# EAGLE design VerberBaby (EAGLE 9.6.0)
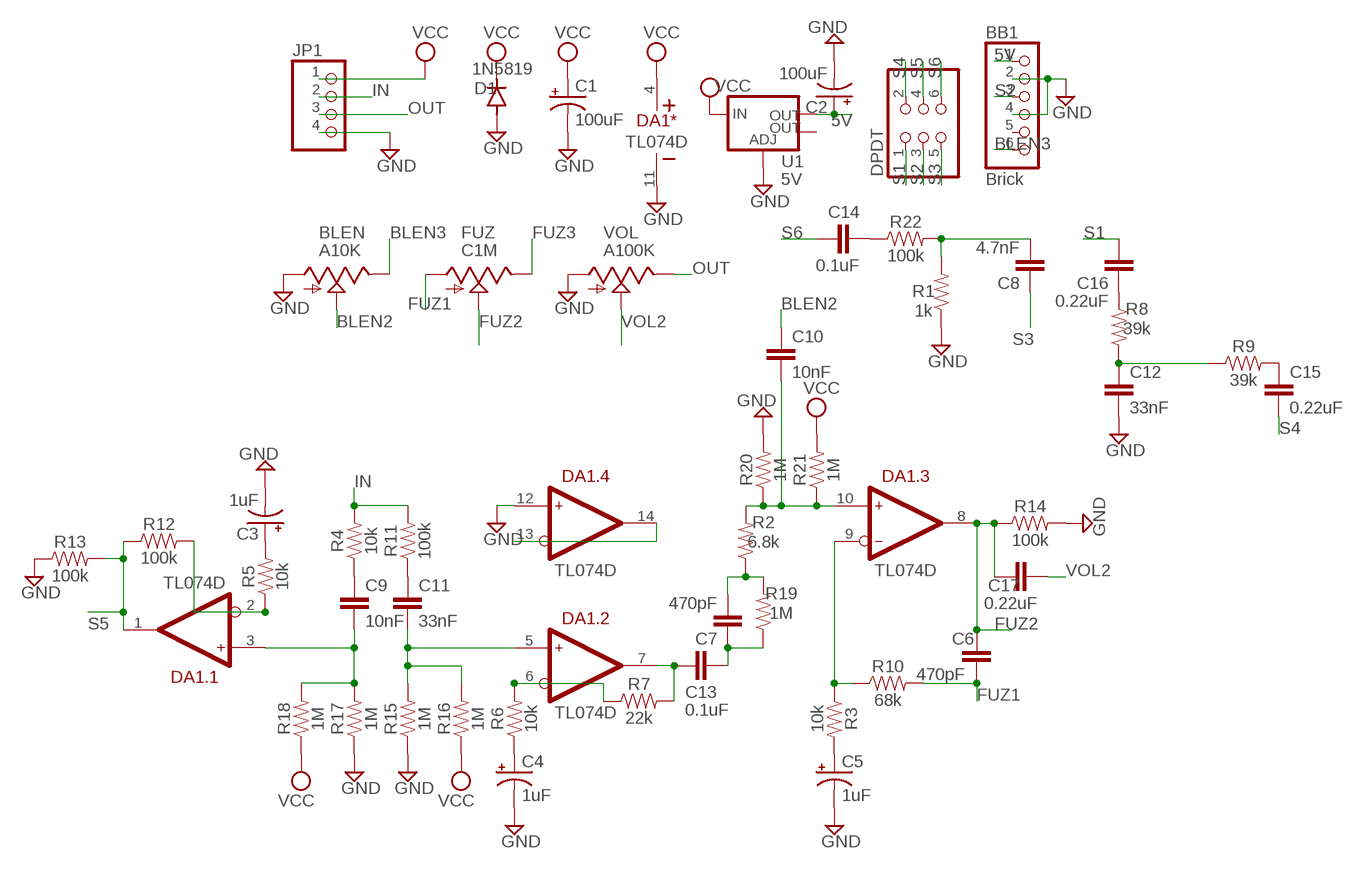
[diagram p0: schematic, sheet 1]

## Parts
BB1  Brick  PINHD-1X6  [1X06]
BLEN  A10K  9MM_SNAP-IN_POT_  [9MM_SNAP-IN_POT]
C1  100uF  CAP_SMD+THRUPAN_B  [PAN_B_SMD+THRU]
C2  100uF  CAP_SMD+THRUPAN_B  [PAN_B_SMD+THRU]
C3  1uF  CAP_SMD+THRUPAN_B  [PAN_B_SMD+THRU]
C4  1uF  CAP_SMD+THRUPAN_B  [PAN_B_SMD+THRU]
C5  1uF  CAP_SMD+THRUPAN_B  [PAN_B_SMD+THRU]
C6  470pF  470PF-0603-50V-5%  [0603]
C7  470pF  470PF-0603-50V-5%  [0603]
C8  4.7nF  4.7PF-0603-50V-5%  [0603]
C9  10nF  10NF-0603-50V-10%  [0603]
C10  10nF  10NF-0603-50V-10%  [0603]
C11  33nF  33NF-0603-50V-10%  [0603]
C12  33nF  33NF-0603-50V-10%  [0603]
C13  0.1uF  0.1UF-0603-25V-(+80/-20%)  [0603]
C14  0.1uF  0.1UF-0603-25V-(+80/-20%)  [0603]
C15  0.22uF  0.22UF-0603-25V-10%  [0603]
C16  0.22uF  0.22UF-0603-25V-10%  [0603]
C17  0.22uF  0.22UF-0603-25V-10%  [0603]
D1  1N5819  DIODE-SOD123  [SOD123]
DA1  TL074D  [SO-14]
DPDT  PINHD-2X3  [2X03]
FUZ  C1M  9MM_SNAP-IN_POT_  [9MM_SNAP-IN_POT]
JP1  PINHD-1X4  [1X04]
R1  1k  1KOHM-0603-1/10W-1%  [0603]
R2  6.8k  6.8KOHM-0603-1/10W-1%  [0603]
R3  10k  10KOHM-0603-1/10W-1%  [0603]
R4  10k  10KOHM-0603-1/10W-1%  [0603]
R5  10k  10KOHM-0603-1/10W-1%  [0603]
R6  10k  10KOHM-0603-1/10W-1%  [0603]
R7  22k  22KOHM-0603-1/10W-1%  [0603]
R8  39k  39KOHM-0603-1/10W-1%  [0603]
R9  39k  39KOHM-0603-1/10W-1%  [0603]
R10  68k  68.1KOHM-0603-1/10W-1%  [0603]
R11  100k  100KOHM-0603-1/10W-1%  [0603]
R12  100k  100KOHM-0603-1/10W-1%  [0603]
R13  100k  100KOHM-0603-1/10W-1%  [0603]
R14  100k  100KOHM-0603-1/10W-1%  [0603]
R15  1M  1MOHM-0603-1/4W-5%  [0603]
R16  1M  1MOHM-0603-1/4W-5%  [0603]
R17  1M  1MOHM-0603-1/4W-5%  [0603]
R18  1M  1MOHM-0603-1/4W-5%  [0603]
R19  1M  1MOHM-0603-1/4W-5%  [0603]
R20  1M  1MOHM-0603-1/4W-5%  [0603]
R21  1M  1MOHM-0603-1/4W-5%  [0603]
R22  100k  100KOHM-0603-1/10W-1%  [0603]
U1  5V  V_REG_LM1117SOT223  [SOT223]
VOL  A100K  9MM_SNAP-IN_POT_  [9MM_SNAP-IN_POT]

## Nets
5V: BB1.1 C2.+ C2.++(+) U1.2(OUT)
BLEN2: BLEN.2(S) C10.1
BLEN3: BB1.6 BLEN.3(E)
FUZ1: C6.2 FUZ.1(A) R10.2
FUZ2: C6.1 C17.1 DA1.8(.3:OUT) FUZ.2(S) R14.1
FUZ3: FUZ.3(E)
GND: BB1.2 BB1.4 BLEN.1(A) C1.- C1.--(-) C2.- C2.--(-) C3.- C3.--(-) C4.- C4.--(-) C5.- C5.--(-) C12.2 D1.A DA1.11(*:V-) DA1.12(.4:IN+) JP1.4 R1.1 R13.1 R14.2 R15.1 R17.1 R20.2 U1.1(ADJ) VOL.1(A)
IN: JP1.2 R4.2 R11.2
N1: DA1.9(.3:IN-) R3.1 R10.1
N$1: C11.1 R11.1
N$2: C9.1 R4.1
N$3: C11.2 DA1.5(.2:IN+) R15.2 R16.2
N$4: C9.2 DA1.3(.1:IN+) R17.2 R18.2
N$5: DA1.2(.1:IN-) R5.1 R12.2
N$6: C3.+ C3.++(+) R5.2
N$7: DA1.6(.2:IN-) R6.2 R7.1
N$8: C4.+ C4.++(+) R6.1
N$9: C13.2 DA1.7(.2:OUT) R7.2
N$10: C7.1 C13.1 R19.1
N$11: C7.2 R2.1 R19.2
N$12: C10.2 DA1.10(.3:IN+) R2.2 R20.1 R21.1
N$13: DA1.13(.4:IN-) DA1.14(.4:OUT)
N$14: C5.+ C5.++(+) R3.2
N$15: C14.2 R22.1
N$16: C8.2 R1.2 R22.2
N$17: C16.1 R8.2
N$18: C12.1 R8.1 R9.1
N$19: C15.1 R9.2
OUT: JP1.3 VOL.3(E)
S1: C16.2 DPDT.1
S2: BB1.3 DPDT.3
S3: C8.1 DPDT.5
S4: C15.2 DPDT.2
S5: DA1.1(.1:OUT) DPDT.4 R12.1 R13.2
S6: C14.1 DPDT.6
VCC: C1.+ C1.++(+) D1.C DA1.4(*:V+) JP1.1 R16.1 R18.1 R21.2 U1.3(IN)
VOL2: C17.2 VOL.2(S)
Unconnected: BB1.5 U1.4(OUT)

## Library data of the parts
BB1 = pinhead:PINHD-1X6: PIN HEADER
BLEN FUZ VOL = MusicThingModular:9MM_SNAP-IN_POT: 9mm vertical snap-in pot, Alpha / Panasonic style
C1-C5 = MusicThingModular:CAP_SMD+THRU
C6 C7 = SparkFun-Capacitors:470PF: 470pF ceramic capacitors A capacitor is a passive two-terminal electrical component used to store electrical energy temporarily in an electric field.; PROD_ID: CAP-07884
C8 = SparkFun-Capacitors:4.7PF: 4.7pF ceramic capacitors A capacitor is a passive two-terminal electrical component used to store electrical energy temporarily in an electric field.; PROD_ID: CAP-07880; VALUE: 4.7pF
C9 C10 = SparkFun-Capacitors:10NF: 0.01uF/10nF/10,000pF ceramic capacitors A capacitor is a passive two-terminal electrical component used to store electrical energy temporarily in an electric field. CAP-09321; PROD_ID: CAP-00867
C11 C12 = SparkFun-Capacitors:33NF: 33nF ceramic capacitors A capacitor is a passive two-terminal electrical component used to store electrical energy temporarily in an electric field.; PROD_ID: CAP-07887
C13 C14 = SparkFun-Capacitors:0.1UF: 0.1µF ceramic capacitors A capacitor is a passive two-terminal electrical component used to store electrical energy temporarily in an electric field.; PROD_ID: CAP-00810
C15-C17 = SparkFun-Capacitors:0.22UF: 0.22µF ceramic capacitors A capacitor is a passive two-terminal electrical component used to store electrical energy temporarily in an electric field.; PROD_ID: CAP-07822
D1 = diode:DIODE-: DIODE
DA1 = ic-ti:TL074
DPDT = pinhead:PINHD-2X3: PIN HEADER
JP1 = Connector:PINHD-1X4: PIN HEADER; CATEGORY: CONNECTOR; SUB-CATEGORY: PIN-HEADER
R1 = SparkFun-Resistors:1KOHM: 1kΩ resistor A resistor is a passive two-terminal electrical component that implements electrical resistance as a circuit element. Resistors act to reduce current flow, and, at the same time, act to lower voltage levels within circuits. - Wikipedia; PROD_ID: RES-07856
R2 = SparkFun-Resistors:6.8KOHM: 6.8kΩ resistor A resistor is a passive two-terminal electrical component that implements electrical resistance as a circuit element. Resistors act to reduce current flow, and, at the same time, act to lower voltage levels within circuits. - Wikipedia; PROD_ID: RES-08597
R3-R6 = SparkFun-Resistors:10KOHM: 10kΩ resistor A resistor is a passive two-terminal electrical component that implements electrical resistance as a circuit element. Resistors act to reduce current flow, and, at the same time, act to lower voltage levels within circuits. - Wikipedia; PROD_ID: RES-00824
R7 = SparkFun-Resistors:22KOHM: 22kΩ resistor A resistor is a passive two-terminal electrical component that implements electrical resistance as a circuit element. Resistors act to reduce current flow, and, at the same time, act to lower voltage levels within circuits. - Wikipedia; PROD_ID: RES-07853
R8 R9 = SparkFun-Resistors:39KOHM: 39kΩ resistor A resistor is a passive two-terminal electrical component that implements electrical resistance as a circuit element. Resistors act to reduce current flow, and, at the same time, act to lower voltage levels within circuits. - Wikipedia; PROD_ID: RES-12377
R10 = SparkFun-Resistors:68.1KOHM: 68.1kΩ resistor A resistor is a passive two-terminal electrical component that implements electrical resistance as a circuit element. Resistors act to reduce current flow, and, at the same time, act to lower voltage levels within circuits. - Wikipedia; PROD_ID: RES-09380; VALUE: 68.1k
R11-R14 R22 = SparkFun-Resistors:100KOHM: 100kΩ resistor A resistor is a passive two-terminal electrical component that implements electrical resistance as a circuit element. Resistors act to reduce current flow, and, at the same time, act to lower voltage levels within circuits. - Wikipedia; PROD_ID: RES-07828
R15-R21 = SparkFun-Resistors:1MOHM: 1MΩ resistor A resistor is a passive two-terminal electrical component that implements electrical resistance as a circuit element. Resistors act to reduce current flow, and, at the same time, act to lower voltage levels within circuits. - Wikipedia; PROD_ID: RES-07868
U1 = SparkFun-IC-Power:V_REG_LM1117: Voltage Regulator LM1117 Standard adjustable voltage regulator but in SMD form. Spark Fun Electronics SKU : COM-00595; PROD_ID: VREG-08170

## Board
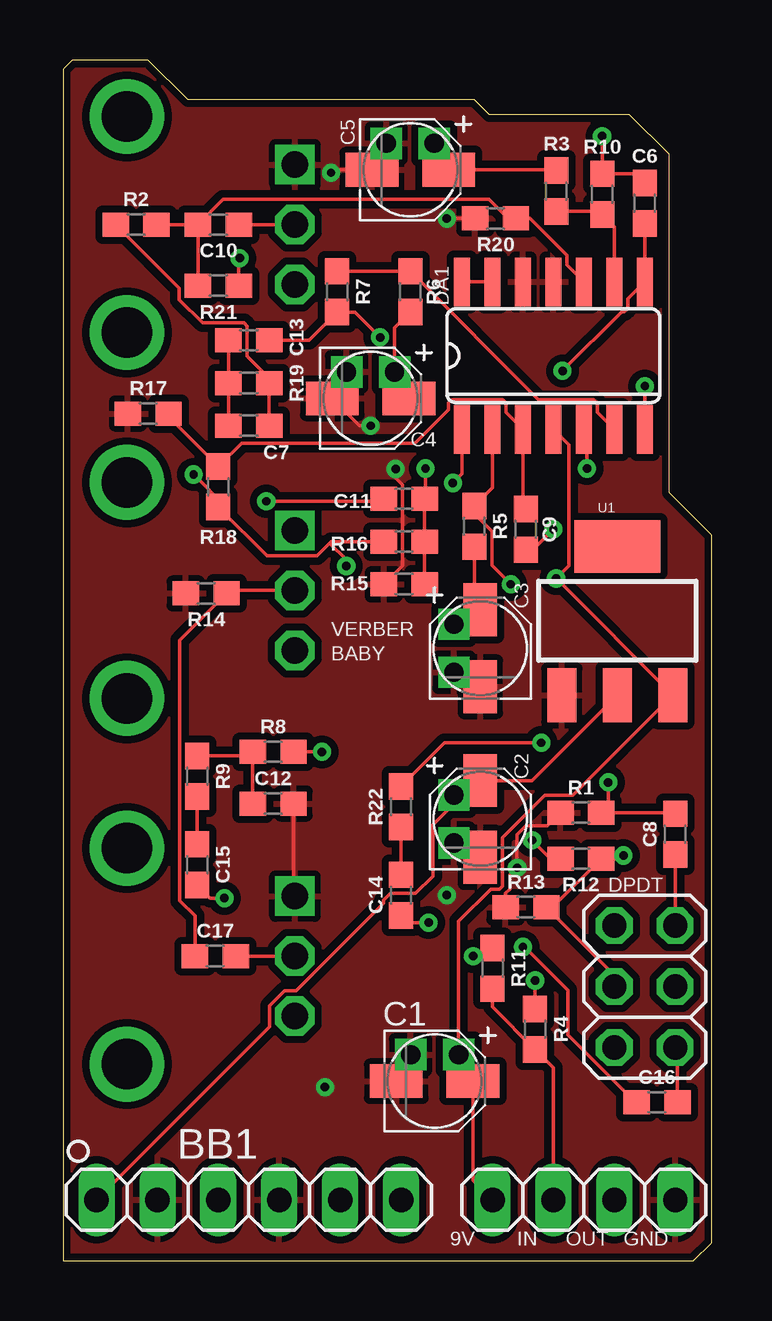
[diagram p1: board, top side]
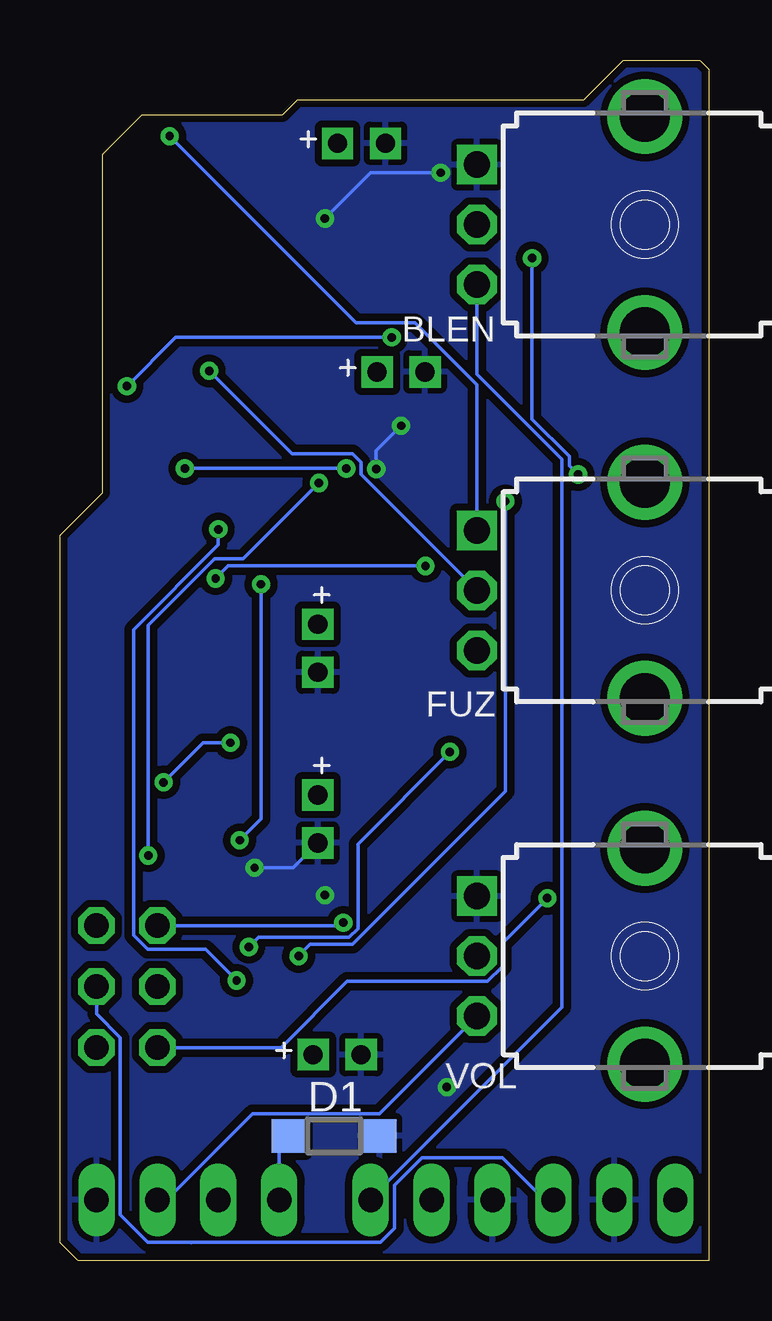
[diagram p2: board, bottom side, seen from below]

Size 27.05 x 50.04 mm. Coordinates in mm from the lower left corner, seen from the top.
Outline: 0,0 26.29,0 27.05,0.76 27.05,30.23 25.27,32 25.27,46.1 23.62,47.75 17.78,47.75 17.14,48.39 5.21,48.39 3.56,50.04 0.38,50.04 0,49.66 0,0
Copper layers (1*16): Top 0.035mm / dielectric 1.5mm / Bottom 0.035mm
Design rules "default *": minimum track width 6mil, minimum drill 0.35mm, track to track 6mil, track to pad 6mil, pad to pad 6mil, via to via 6mil, smd to smd 6mil, copper to edge 6mil, drill to drill 6mil, minimum pad ring 10mil, minimum via ring 8mil, stop-mask expansion 4mil, vias tented up to drill 0mil, thermal gap 10mil

### Footprints (pad centres in the part's own frame; a part is rotated, then mirrored left to right if it is on the bottom)
1X06 = drill 1.016 long: 1 -6.35,0; 2 -3.81,0; 3 -1.27,0; 4 1.27,0; 5 3.81,0; 6 6.35,0
9MM_SNAP-IN_POT = drill 1.1 square: 1 -2.5,-7 | drill 1.1 octagon: 2 0,-7; 3 2.5,-7 | drill 2.1 pad 2.794: CHASSIS1 -4.5,0; CHASSIS2 4.5,0
PAN_B_SMD+THRU = smd 2.2 x 1.4: + 1.6,0; - -1.6,0 | drill 0.8 pad 0.9 square: ++ 1,1.1; -- -1,1.1
0603 = smd 1.1 x 1: 1 -0.85,0; 2 0.85,0
SOD123 = smd 1.4 x 1.4: A 1.9,0; C -1.9,0
SO-14 = smd 0.66 x 2.032: 1 -3.81,-3.073; 2 -2.54,-3.073; 3 -1.27,-3.073; 4 0,-3.073; 5 1.27,-3.073; 6 2.54,-3.073; 7 3.81,-3.073; 8 3.81,3.073; 9 2.54,3.073; 10 1.27,3.073; 11 0,3.073; 12 -1.27,3.073; 13 -2.54,3.073; 14 -3.81,3.073
2X03 = drill 1.016 octagon: 1 -2.54,-1.27; 2 -2.54,1.27; 3 0,-1.27; 4 0,1.27; 5 2.54,-1.27; 6 2.54,1.27
1X04 = drill 1.016 long: 1 -3.81,0; 2 -1.27,0; 3 1.27,0; 4 3.81,0
SOT223 = smd 1.219 x 2.235: 1 -2.311,-3.099; 2 0,-3.099; 3 2.311,-3.099 | smd 3.6 x 2.2: 4 0,3.099

### Placement (x,y rotation side)
BB1  7.75,2.54 0 top
BLEN  2.67,43.18 270 bottom
C1  15.49,7.49 0 top
C2  17.4,18.41 90 top
C3  17.4,25.53 90 top
C4  12.83,35.94 0 top
C5  14.48,45.47 0 top
C6  24.26,44.07 90 top
C7  7.75,34.8 0 top
C8  25.53,17.78 90 top
C9  19.3,30.48 90 top
C10  6.48,43.18 180 top
C11  14.22,31.75 0 top
C12  8.76,19.05 0 top
C13  7.75,38.35 0 top
C14  14.1,15.24 90 top
C15  5.59,16.51 270 top
C16  24.77,6.6 0 top
C17  6.35,12.7 0 top
D1  15.62,5.21 0 bottom
DA1  20.45,37.72 0 top
DPDT  24.26,11.43 90 top
FUZ  2.67,27.94 270 bottom
JP1  21.72,2.54 0 top
R1  21.59,18.67 0 top
R2  3.05,43.18 0 top
R3  20.57,44.58 90 top
R4  19.68,9.65 270 top
R5  17.14,30.61 270 top
R6  14.48,40.39 90 top
R7  11.43,40.39 270 top
R8  8.76,21.21 0 top
R9  5.59,20.19 270 top
R10  22.48,44.45 90 top
R11  17.91,12.19 270 top
R12  21.59,16.76 180 top
R13  19.3,14.73 0 top
R14  5.97,27.81 180 top
R15  14.22,28.19 0 top
R16  14.22,29.97 0 top
R17  3.56,35.31 0 top
R18  6.48,32.26 90 top
R19  7.75,36.58 0 top
R20  18.03,43.43 180 top
R21  6.48,40.64 0 top
R22  14.1,18.92 90 top
U1  23.11,26.67 0 top
VOL  2.67,12.7 270 bottom

### Tracks (layer width: path | path; a pad name or v marks a point on that pad's centre or on a via)
5V
  Top 0.152: U1.2 19.56,20.02 C2.+ 16.8,19.41 16.38,19.41 | 16.38,19.41 C2.++ | BB1.1 8.61,9.76 8.61,10.64 9.23,11.25 9.71,11.25 13.37,14.91 13.37,15.04 13.64,15.31 14.69,15.31 15.42,16.04 15.42,18.16 16.38,19.13 16.38,19.41
BLEN2
  Top 0.152: C10.1 BLEN.2
BLEN3
  Bottom 0.152: BLEN.3 9.67,36.94 6.12,33.4 6.12,10.57 13.41,3.28 13.41,3.23 BB1.6
FUZ1  (via drill 0.35)
  Top 0.152: C6.2 23.88,45.3 R10.2 v22.48,46.86
  Bottom 0.152: v22.48,46.86 14.7,39.09 12.24,39.09 9.67,36.51 FUZ.1
FUZ2  (via drill 0.35)
  Top 0.152: C6.1 DA1.8 23.55,40.08 23.55,39.68 23.41,39.55 23.29,39.55 v20.83,37.08 | FUZ.2 6.95,27.94 R14.1 4.86,25.85 4.86,15.02 5.5,14.38 C17.1
  Bottom 0.152: v20.83,37.08 17.37,33.63 14.86,33.63 14.51,33.27 14.51,32.78 FUZ.2
GND  (via drill 0.35)
  Top 0.152: C4.- 12.37,34.8 v12.83,34.8 | v13.87,33 13.87,32.63 14.15,32.34 14.15,28.97 R15.1 | C5.- 11.3,45.47 v11.18,45.34 | v16,43.43 R20.2 | R1.1 20.2,18.13 19.31,18.13 18.93,17.76 v18.93,16.38 18.63,16.08 18.63,15.49 18.45,15.32 R13.1 | C2.- 16.9,16.82 C2.-- | VOL.1 9.61,15.25 C12.2
  Bottom 0.152: v12.83,34.8 13.87,33.76 v13.87,33 | v11.18,45.34 14.1,45.34 v16,43.43 | v18.93,16.38 17.33,16.38 C2.--
  other vias: 10.92,7.24 16,15.24
  pour Top (isolate 0.305): -0.51,50.8 -0.51,-0.38 -0.25,-0.64 26.42,-0.64 27.81,0.76 27.81,44.58 21.72,50.67 -0.38,50.67
  pour Bottom (isolate 0.305): -0.38,50.8 -0.38,0 0.38,-0.76 26.29,-0.76 27.81,0.76 27.81,44.7 21.84,50.67 21.59,50.67 21.46,50.8
IN
  Top 0.152: JP1.2 20.45,8.04 R4.2 17.91,10.58 R11.2
N1
  Top 0.152: R3.1 22.35,43.73 R10.1 22.99,43.09 DA1.9
N$1  (via drill 0.35)
  Top 0.152: R11.1 17.57,12.7 v17.1,12.7 | v8.48,31.65 13.28,31.65 C11.1
  Bottom 0.152: v17.1,12.7 16.61,13.19 14.86,13.19 8.48,19.57 v8.48,31.65
N$2  (via drill 0.35)
  Top 0.152: R4.1 v19.68,11.68 | v20.45,30.48 19.6,29.63 C9.1
  Bottom 0.152: v20.45,30.48 20.45,29.84 23.98,26.31 23.98,13.56 23.4,12.98 20.98,12.98 v19.68,11.68
N$3  (via drill 0.35)
  Top 0.152: DA1.5 21.84,34.52 v21.84,33.02 | v15.11,33.02 15.11,31.79 C11.2 R16.2 R15.2
  Bottom 0.152: v21.84,33.02 v15.11,33.02
N$4
  Top 0.152: C9.2 19.18,31.46 DA1.3 18.47,35.36 18.47,35.76 18.33,35.89 16.21,35.89 16.08,35.76 16.08,35.47 14.68,34.07 7.44,34.07 R18.2 4.41,35.18 R17.2
N$5  (via drill 0.35)
  Top 0.152: DA1.2 17.91,32.22 R5.1 17.14,31.13 17.87,30.4 17.87,28.99 v18.67,28.19 | R12.2 20.32,16.76 v19.56,17.53
  Bottom 0.152: v19.56,17.53 18.67,18.41 v18.67,28.19
N$6
  Top 0.152: R5.2 17.14,27.38 C3.+ 16.9,27.13 C3.++
N$7
  Top 0.152: DA1.6 22.28,35.36 22.28,35.76 22.14,35.89 19.82,35.89 14.52,41.19 R6.2 R7.1
N$8
  Top 0.152: C4.+ 14.43,36.44 C4.++ 13.83,38.88 R6.1
N$9  (via drill 0.35)
  Top 0.152: v13.22,38.48 12.16,39.54 R7.2 10.25,38.35 C13.2 | v24.26,36.45 DA1.7
  Bottom 0.152: v13.22,38.48 22.23,38.48 v24.26,36.45
N$10
  Top 0.152: C13.1 R19.1 C7.1
N$11
  Top 0.152: C7.2 R19.2 8.6,36.78 7.68,37.7 7.68,38.95 7.54,39.08 5.81,39.08 4.85,40.05 4.85,40.53 R2.1
N$12
  Top 0.152: R21.1 C10.2 | C10.2 R2.2 | DA1.10 21.01,41.5 21.01,41.9 19.48,43.43 18.92,43.43 R20.1 18.56,43.43 17.76,44.23 6.68,44.23 C10.2
N$13
  Top 0.152: DA1.13 DA1.14
N$14
  Top 0.152: R3.2 20.54,45.47 C5.+ 15.48,46.07 C5.++
N$15
  Top 0.152: C14.2 R22.1
N$16  (via drill 0.35)
  Top 0.152: C8.2 25.49,18.67 R1.2 22.73,18.96 v22.73,19.94 | R22.2 15.91,21.59 v19.94,21.59
  Bottom 0.152: v19.94,21.59 21.08,21.59 v22.73,19.94
N$17  (via drill 0.35)
  Top 0.152: C16.1 23.87,6.6 21.05,9.43 21.05,11.27 19.24,13.08 v19.18,13.08 | v10.79,21.21 R8.2
  Bottom 0.152: v19.18,13.08 18.77,13.49 14.99,13.49 14.63,13.85 14.63,17.37 v10.79,21.21
N$18
  Top 0.152: R9.1 7.75,21.04 R8.1 C12.1
N$19
  Top 0.152: C15.1 R9.2
OUT
  Bottom 0.152: VOL.3 13.73,6.14 19.01,6.14 22.61,2.54 JP1.3
S1
  Top 0.152: C16.2 25.61,8.8 DPDT.1
S2
  Bottom 0.152: BB1.3 6.85,2.54 8.61,4.29 11.97,4.29 13.11,3.15 13.11,1.37 13.69,0.79 21.57,0.79 21.59,0.76 21.61,0.79 23.4,0.79 24.54,1.93 24.54,9.3 25.53,10.29 DPDT.3
S3
  Top 0.152: DPDT.5 C8.1
S4  (via drill 0.35)
  Top 0.152: v6.73,15.11 6.13,15.11 C15.2
  Bottom 0.152: DPDT.2 17.83,8.89 15.07,11.65 9.23,11.65 8.61,12.26 8.61,13.23 v6.73,15.11
S5  (via drill 0.35)
  Top 0.152: DPDT.4 22.99,11.9 R13.2 20.41,14.73 R12.1 23.24,16.76 v23.37,16.89 | DA1.1 16.64,32.79 v16.26,32.41
  Bottom 0.152: v16.26,32.41 19.41,29.26 20.59,29.26 23.37,26.49 v23.37,16.89
S6  (via drill 0.35)
  Top 0.152: v15.24,14.1 14.39,14.1 C14.1
  Bottom 0.152: DPDT.6 15.37,13.97 v15.24,14.1
VCC  (via drill 0.35)
  Top 0.152: JP1.1 17.09,3.35 C1.+ 16.49,8.09 C1.++ 16.49,14.14 17.84,15.49 18.19,15.49 18.33,15.62 18.33,17.63 20.09,19.4 21.25,19.4 U1.3 v20.56,28.43 21.08,28.96 21.08,34.01 DA1.4 | 11.11,29.91 11.17,29.97 R16.1 | 11.11,29.91 10.59,29.39 8.5,29.39 6.5,31.39 | R18.1 6.5,31.39 | 11.11,29.91 11.81,29.21 v11.81,28.96 | R21.2 7.33,41.74 v7.37,41.78 | v5.45,32.77 5.75,32.46 6.5,31.71 6.5,31.39
  Bottom 0.152: JP1.1 17.91,4.82 D1.C | v11.81,28.96 20.04,28.96 v20.56,28.43 | v7.37,41.78 7.37,35.07 5.82,33.53 5.82,33.14 v5.45,32.77
VOL2
  Top 0.152: C17.2 VOL.2

### Text on the board
tPlace: VERBER | BABY | 9V | IN | OUT | GND